# EAGLE schematic cooler (EAGLE 7.7.0)
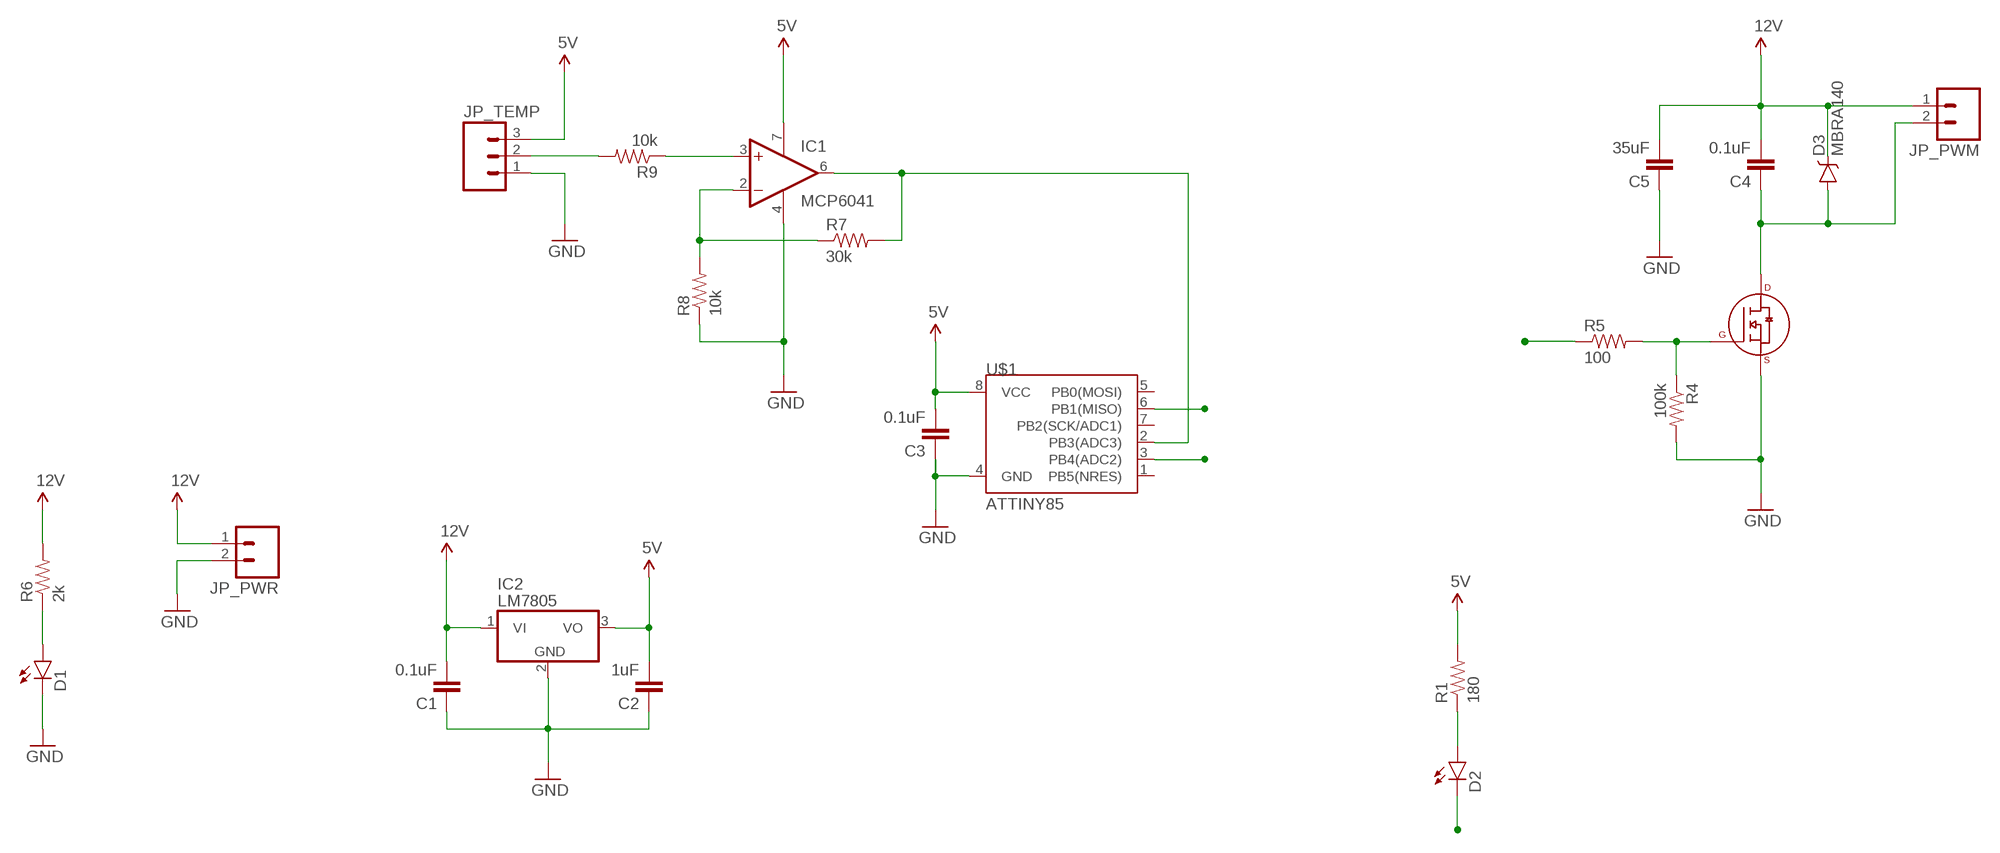
[diagram p0: schematic, sheet 1]

## Parts
C1  0.1uF  22UF-16V-20%-(1210)  [1210]
C2  1uF  22UF-16V-20%-(1210)  [1210]
C3  0.1uF  22UF-16V-20%-(1210)  [1210]
C4  0.1uF  22UF-16V-20%-(1210)  [1210]
C5  35uF  22UF-16V-20%-(1210)  [1210]
D1  LED1206  [LED-1206]
D2  LED1206  [LED-1206]
D3  MBRA140  DIODE-SCHOTTKY-MBRA140  [SMA-DIODE]
IC1  MCP6041  MCP601SN  [SO08]
IC2  LM7805  7805TV  [TO220V]
JP_PWM  M02LOCK_LONGPADS  [1X02_LOCK_LONGPADS]
JP_PWR  M02LOCK_LONGPADS  [1X02_LOCK_LONGPADS]
JP_TEMP  M03LONGPADS  [1X03_LONGPADS]
Q2  2N7000-2SOT-23  [SOT-23-3]
R1  180  0.11OHM1/2W1%(2010)  [R2010]
R4  100k  0.11OHM1/2W1%(2010)  [R2010]
R5  100  0.11OHM1/2W1%(2010)  [R2010]
R6  2k  0.11OHM1/2W1%(2010)  [R2010]
R7  30k  0.11OHM1/2W1%(2010)  [R2010]
R8  10k  0.11OHM1/2W1%(2010)  [R2010]
R9  10k  0.11OHM1/2W1%(2010)  [R2010]
U$1  ATTINY85  ATTINY13SOIC  [SO08]

## Nets
5V: C2.2 C3.2 IC1.7(V+) IC2.3(VO) JP_TEMP.3 R1.2 U$1.8(VCC)
12V: C1.2 C4.2 C5.2 D3.C IC2.1(VI) JP_PWM.1 JP_PWR.1 R6.2
ADC_IN: IC1.6(OUT) R7.2 U$1.2(PB3(ADC3))
GND: C1.1 C2.1 C3.1 C5.1 D1.C IC1.4(V-) IC2.2(GND) JP_PWR.2 JP_TEMP.1 Q2.2(S) R4.2 R8.1 U$1.4(GND)
LED: D2.C U$1.3(PB4(ADC2))
N$2: Q2.1(G) R4.1 R5.2
N$3: D1.A R6.1
N$4: IC1.3(+IN) R9.1
N$6: IC1.2(-IN) R7.1 R8.2
N$9: D2.A R1.1
N$10: C4.1 D3.A JP_PWM.2 Q2.3(D)
PWM: R5.1 U$1.6(PB1(MISO))
TMP_IN: JP_TEMP.2 R9.2
Unconnected: U$1.1(PB5(NRES)) U$1.5(PB0(MOSI)) U$1.7(PB2(SCK/ADC1))

## Library data of the parts
C1-C5 = SparkFun-Capacitors:22UF-16V-20%-(1210): CAP-10381; PROD_ID: CAP-10381; VALUE: 22uF
D1 D2 = SparkFun-LED:LED: LEDs Standard schematic elements and footprints for 5mm, 3mm, 1206, and 0603 sized LEDs. 5mm - Spark Fun Electronics SKU : COM-00529 (and others)
D3 = SparkFun-DiscreteSemi:DIODE-SCHOTTKY: Schottky diodes in SFE's production catalog BAT20J 1A 23V 0.62Vf RB751 120mA 40V 0.37Vf PMEG4005EJ 0.5A 40V 0.42Vf MBRA140 1A 40V 0.5Vf B340A 3A 40V SMA; PROD_ID: DIO-08053
IC1 = linear:MCP601: Single Op Amp 2.7V to 6.0V Single Supply CMOS Source: http://ww1.microchip.com/downloads/en/DeviceDoc/21314g.pdf
IC2 = linear:78*: Positive VOLTAGE REGULATOR Source: http://cache.national.com/ds/LM/LM78L05.pdf http://www.fairchildsemi.com/ds/LM/LM7805.pdf
JP_PWM JP_PWR = SparkFun-Connectors:M02: Standard 2-pin 0.1" header. Use with - straight break away headers ( PRT-00116) - right angle break away headers (PRT-00553) - swiss pins (PRT-00743) - machine pins (PRT-00117) - female headers (PRT-00115) Molex polarized connector foot print use with: PRT-08233 with associated crimp pins and housings. 2.54_SCREWTERM for use with PRT-10571. 3.5mm Screw Terminal footprints for PRT-08084 5mm Screw Terminal footprints for use with PRT-08432
JP_TEMP = SparkFun-Connectors:M03: Header 3 Standard 3-pin 0.1" header. Use with straight break away headers (SKU : PRT-00116), right angle break away headers (PRT-00553), swiss pins (PRT-00743), machine pins (PRT-00117), and female headers (PRT-00115). Molex polarized connector foot print use with SKU : PRT-08232 with associated crimp pins and housings.
Q2 = Synapseware:2N7000-2: N-Channel Enhancement Mode Field Effect Transistor
R1 R4-R9 = SparkFun-Resistors:0.11OHM1/2W1%(2010): RES-08354; PROD_ID: RES-08354
U$1 = SparkFun-DigitalIC:ATTINY13: Atmel 8-pin 1kB flash uC